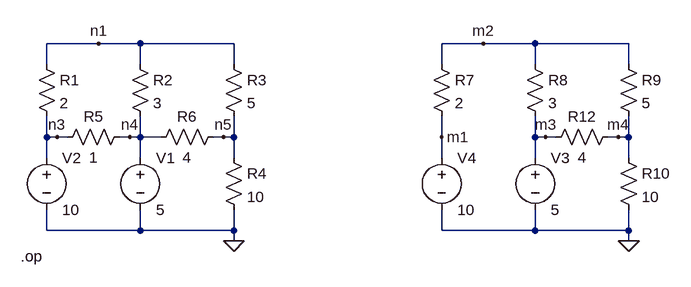
[diagram p0: schematic g2_p8.asc]
g2_p8.asc, the LTspice schematic file:
Version 4.1
SHEET 1 1028 680
WIRE 144 96 64 96
WIRE 208 96 144 96
WIRE 352 96 208 96
WIRE 736 96 672 96
WIRE 816 96 736 96
WIRE 960 96 816 96
WIRE 64 128 64 96
WIRE 208 128 208 96
WIRE 352 128 352 96
WIRE 672 128 672 96
WIRE 816 128 816 96
WIRE 960 128 960 96
WIRE 64 240 64 208
WIRE 80 240 64 240
WIRE 96 240 80 240
WIRE 192 240 176 240
WIRE 208 240 208 208
WIRE 208 240 192 240
WIRE 240 240 208 240
WIRE 336 240 320 240
WIRE 352 240 352 208
WIRE 352 240 336 240
WIRE 672 240 672 208
WIRE 816 240 816 208
WIRE 832 240 816 240
WIRE 848 240 832 240
WIRE 944 240 928 240
WIRE 960 240 960 208
WIRE 960 240 944 240
WIRE 64 272 64 240
WIRE 208 272 208 240
WIRE 352 272 352 240
WIRE 672 272 672 240
WIRE 816 272 816 240
WIRE 960 272 960 240
WIRE 64 384 64 352
WIRE 208 384 208 352
WIRE 208 384 64 384
WIRE 352 384 352 352
WIRE 352 384 208 384
WIRE 672 384 672 352
WIRE 816 384 816 352
WIRE 816 384 672 384
WIRE 960 384 960 352
WIRE 960 384 816 384
WIRE 352 400 352 384
WIRE 960 400 960 384
FLAG 352 400 0
FLAG 960 400 0
FLAG 144 96 n1
FLAG 80 240 n3
FLAG 192 240 n4
FLAG 336 240 n5
FLAG 672 240 m1
FLAG 736 96 m2
FLAG 832 240 m3
FLAG 944 240 m4
SYMBOL res 48 112 R0
SYMATTR InstName R1
SYMATTR Value 2
SYMBOL res 192 112 R0
SYMATTR InstName R2
SYMATTR Value 3
SYMBOL res 336 112 R0
SYMATTR InstName R3
SYMATTR Value 5
SYMBOL res 336 256 R0
SYMATTR InstName R4
SYMATTR Value 10
SYMBOL res 192 224 R90
WINDOW 0 0 56 VBottom 2
WINDOW 3 32 56 VTop 2
SYMATTR InstName R5
SYMATTR Value 1
SYMBOL res 336 224 R90
WINDOW 0 0 56 VBottom 2
WINDOW 3 32 56 VTop 2
SYMATTR InstName R6
SYMATTR Value 4
SYMBOL voltage 208 256 R0
WINDOW 123 0 0 Left 0
WINDOW 39 0 0 Left 0
SYMATTR InstName V1
SYMATTR Value 5
SYMBOL voltage 64 256 R0
WINDOW 123 0 0 Left 0
WINDOW 39 0 0 Left 0
SYMATTR InstName V2
SYMATTR Value 10
SYMBOL res 656 112 R0
SYMATTR InstName R7
SYMATTR Value 2
SYMBOL res 800 112 R0
SYMATTR InstName R8
SYMATTR Value 3
SYMBOL res 944 112 R0
SYMATTR InstName R9
SYMATTR Value 5
SYMBOL res 944 256 R0
SYMATTR InstName R10
SYMATTR Value 10
SYMBOL res 944 224 R90
WINDOW 0 0 56 VBottom 2
WINDOW 3 32 56 VTop 2
SYMATTR InstName R12
SYMATTR Value 4
SYMBOL voltage 816 256 R0
WINDOW 123 0 0 Left 0
WINDOW 39 0 0 Left 0
SYMATTR InstName V3
SYMATTR Value 5
SYMBOL voltage 672 256 R0
WINDOW 123 0 0 Left 0
WINDOW 39 0 0 Left 0
SYMATTR InstName V4
SYMATTR Value 10
TEXT 24 424 Left 2 !.op

The netlist it stands for:
* g2_p8.asc
R1 n1 n3 2
R2 n1 n4 3
R3 n1 n5 5
R4 n5 0 10
R5 n4 n3 1
R6 n5 n4 4
V1 n4 0 5
V2 n3 0 10
R7 m2 m1 2
R8 m2 m3 3
R9 m2 m4 5
R10 m4 0 10
R12 m4 m3 4
V3 m3 0 5
V4 m1 0 10
.op
.backanno
.end